# EAGLE design working (EAGLE 6.3)

## Sheet 1 of 4
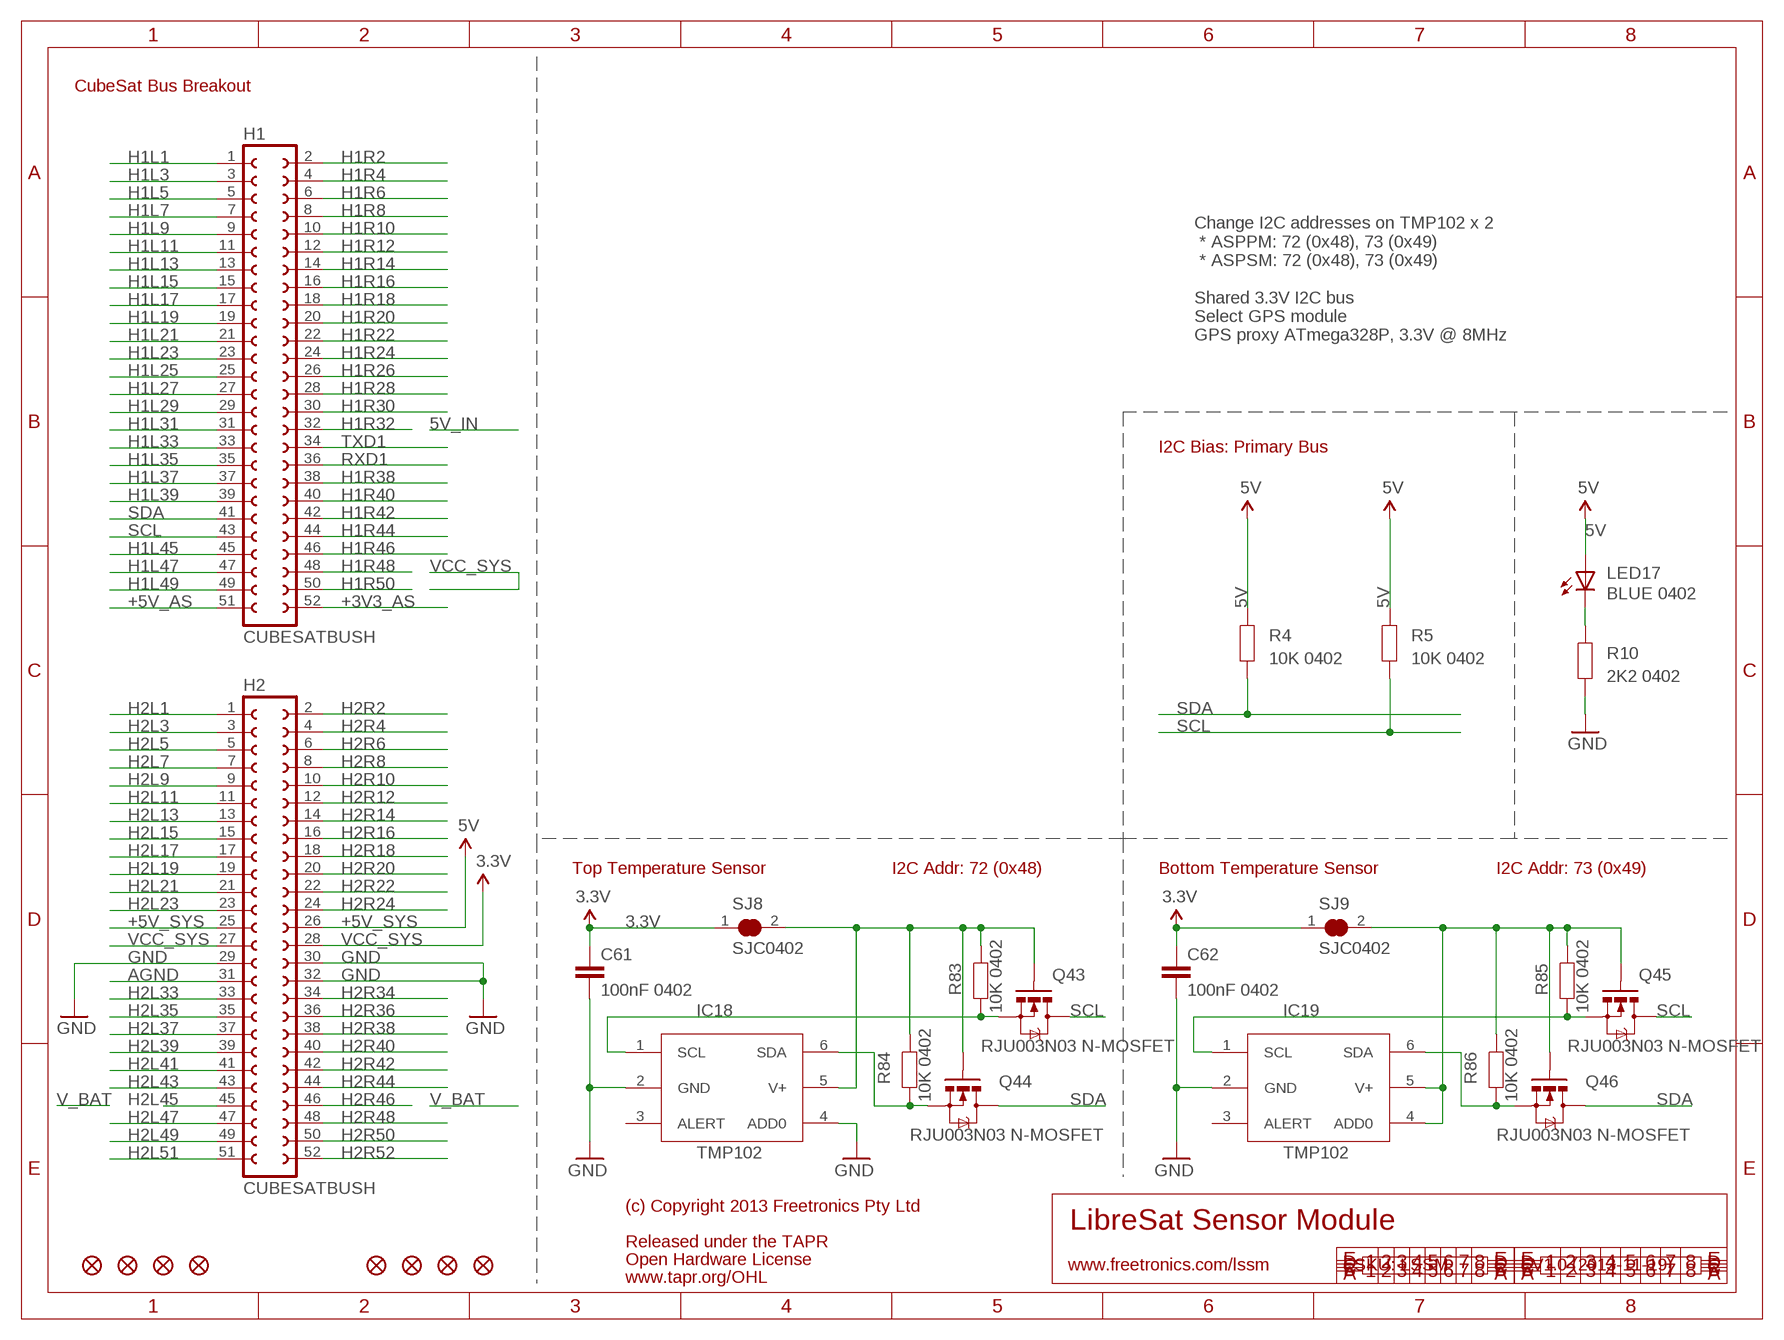
[diagram p0: schematic, sheet 1]

### Parts
C61  100nF 0402  C-EU0402C  [0402C]
C62  100nF 0402  C-EU0402C  [0402C]
FID1  FIDUCIAL1X2.5  [FIDUCIAL-1X2.5]
FID2  FIDUCIAL1X2.5  [FIDUCIAL-1X2.5]
FID3  FIDUCIAL1X2.5  [FIDUCIAL-1X2.5]
FID4  FIDUCIAL1X2.5  [FIDUCIAL-1X2.5]
FID5  FIDUCIAL1X2.5  [FIDUCIAL-1X2.5]
FID6  FIDUCIAL1X2.5  [FIDUCIAL-1X2.5]
FID7  FIDUCIAL1X2.5  [FIDUCIAL-1X2.5]
FID8  FIDUCIAL1X2.5  [FIDUCIAL-1X2.5]
H1  CUBESATBUSH  [CUBESATBUS]
H2  CUBESATBUSH  [CUBESATBUS]
IC18  TMP102  [SOT563]
IC19  TMP102  [SOT563]
LED17  BLUE 0402  LED0402  [LED-0402]
Q43  RJU003N03 N-MOSFET  MOSFET-NSOT-323  [SOT32-3]
Q44  RJU003N03 N-MOSFET  MOSFET-NSOT-323  [SOT32-3]
Q45  RJU003N03 N-MOSFET  MOSFET-NSOT-323  [SOT32-3]
Q46  RJU003N03 N-MOSFET  MOSFET-NSOT-323  [SOT32-3]
R4  10K 0402  RESISTOR0402  [0402]
R5  10K 0402  RESISTOR0402  [0402]
R10  2K2 0402  RESISTOR0402  [0402]
R83  10K 0402  RESISTOR0402  [0402]
R84  10K 0402  RESISTOR0402  [0402]
R85  10K 0402  RESISTOR0402  [0402]
R86  10K 0402  RESISTOR0402  [0402]
SJ8  SJC0402  [0402SJC]
SJ9  SJC0402  [0402SJC]

### Nets
3.3V: C61.1 C62.1 SJ8.1 SJ9.1 ; also sheet 3
5V: LED17.A R4.2 R5.2 ; also sheet 3,4
+3V3_AS: H1.52
+5V_AS: H1.51
+5V_SYS: H2.25 H2.26 ; supply symbol labelled 5V
AGND: H2.31
GND: C61.2 C62.2 H2.29 H2.30 H2.32 IC18.2(GND) IC18.4(ADD0) IC19.2(GND) R10.1 ; also sheet 2,3,4
H1L1: H1.1
H1L3: H1.3
H1L5: H1.5
H1L7: H1.7
H1L9: H1.9
H1L11: H1.11
H1L13: H1.13
H1L15: H1.15
H1L17: H1.17
H1L19: H1.19
H1L21: H1.21
H1L23: H1.23
H1L25: H1.25
H1L27: H1.27
H1L29: H1.29
H1L31: H1.31
H1L33: H1.33
H1L35: H1.35
H1L37: H1.37
H1L39: H1.39
H1L45: H1.45
H1L47: H1.47
H1L49: H1.49
H1R2: H1.2
H1R4: H1.4
H1R6: H1.6
H1R8: H1.8
H1R10: H1.10
H1R12: H1.12
H1R14: H1.14
H1R16: H1.16
H1R18: H1.18
H1R20: H1.20
H1R22: H1.22
H1R24: H1.24
H1R26: H1.26
H1R28: H1.28
H1R30: H1.30
H1R32: H1.32
H1R38: H1.38
H1R40: H1.40
H1R42: H1.42
H1R44: H1.44
H1R46: H1.46
H1R48: H1.48
H1R50: H1.50
H2L1: H2.1
H2L3: H2.3
H2L5: H2.5
H2L7: H2.7
H2L9: H2.9
H2L11: H2.11
H2L13: H2.13
H2L15: H2.15
H2L17: H2.17
H2L19: H2.19
H2L21: H2.21
H2L23: H2.23
H2L33: H2.33
H2L35: H2.35
H2L37: H2.37
H2L39: H2.39
H2L41: H2.41
H2L43: H2.43
H2L45: H2.45
H2L47: H2.47
H2L49: H2.49
H2L51: H2.51
H2R2: H2.2
H2R4: H2.4
H2R6: H2.6
H2R8: H2.8
H2R10: H2.10
H2R12: H2.12
H2R14: H2.14
H2R16: H2.16
H2R18: H2.18
H2R20: H2.20
H2R22: H2.22
H2R24: H2.24
H2R34: H2.34
H2R36: H2.36
H2R38: H2.38
H2R40: H2.40
H2R42: H2.42
H2R44: H2.44
H2R46: H2.46
H2R48: H2.48
H2R50: H2.50
H2R52: H2.52
N$14: LED17.C R10.2
N$9999: IC18.1(SCL) Q43.2(S) R83.1
N$10001: IC18.6(SDA) Q44.2(S) R84.1
N$10002: IC19.6(SDA) Q46.2(S) R86.1
N$10003: IC19.1(SCL) Q45.2(S) R85.1
N$10010: IC18.5(V+) Q43.1(G) Q44.1(G) R83.2 R84.2 SJ8.2
N$10011: IC19.4(ADD0) IC19.5(V+) Q45.1(G) Q46.1(G) R85.2 R86.2 SJ9.2
RXD1: H1.36 ; also sheet 2
SCL: H1.43 Q43.3(D) Q45.3(D) R5.1 ; also sheet 3,4
SDA: H1.41 Q44.3(D) Q46.3(D) R4.1 ; also sheet 3,4
TXD1: H1.34 ; also sheet 2
VCC_SYS: H2.27 H2.28 ; supply symbol labelled 3.3V
Unconnected: IC18.3(ALERT) IC19.3(ALERT)

### Notes on the sheet
- CubeSat Bus Breakout
- Change I2C addresses on TMP102 x 2
   * ASPPM: 72 (0x48), 73 (0x49)
   * ASPSM: 72 (0x48), 73 (0x49)
  
  Shared 3.3V I2C bus
  Select GPS module
  GPS proxy ATmega328P, 3.3V @ 8MHz
- I2C Bias: Primary Bus
- Top Temperature Sensor | I2C Addr: 72 (0x48) | Bottom Temperature Sensor | I2C Addr: 73 (0x49)
- (c) Copyright 2013 Freetronics Pty Ltd
- LibreSat Sensor Module
- Released under the TAPR
- Open Hardware License
- www.freetronics.com/lssm | SKU: LSSM | V1.0 (2013-11-19)
- www.tapr.org/OHL

## Sheet 2 of 4
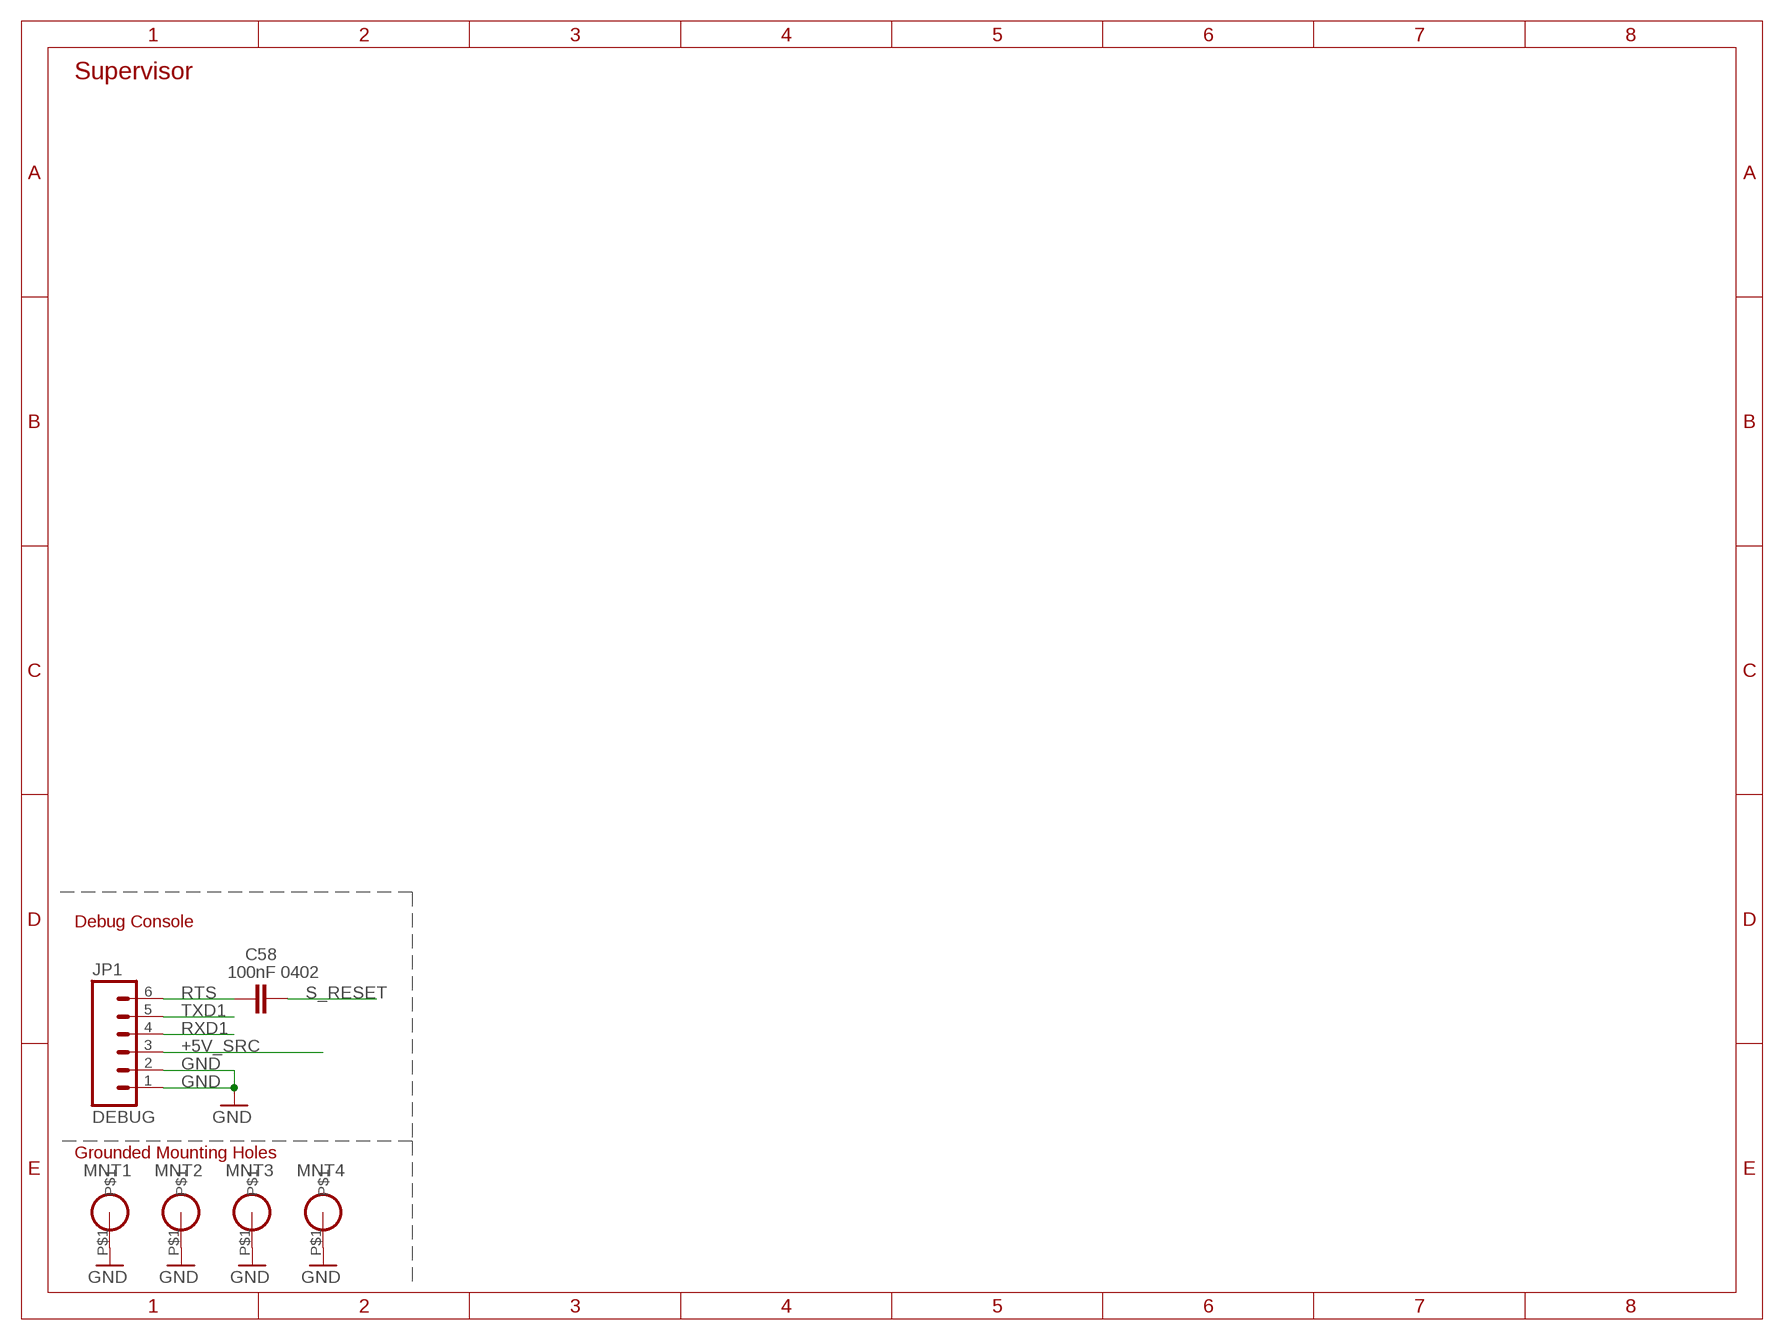
[diagram p1: schematic, sheet 2]

### Parts
C58  100nF 0402  C-EU0402C  [0402C]
JP1  DEBUG  M06RA  [MOLEX-1X6-RA]
MNT1  HOLE3.2MM  [HOLE32]
MNT2  HOLE3.2MM  [HOLE32]
MNT3  HOLE3.2MM  [HOLE32]
MNT4  HOLE3.2MM  [HOLE32]

### Nets
+5V_SRC: JP1.3
GND: JP1.1 JP1.2 MNT1.P$1 MNT2.P$1 MNT3.P$1 MNT4.P$1 ; also sheet 1,3,4
RTS: C58.1 JP1.6
RXD1: JP1.4 ; also sheet 1
S_RESET: C58.2
TXD1: JP1.5 ; also sheet 1

### Notes on the sheet
- Supervisor
- Debug Console
- Grounded Mounting Holes

## Sheet 3 of 4
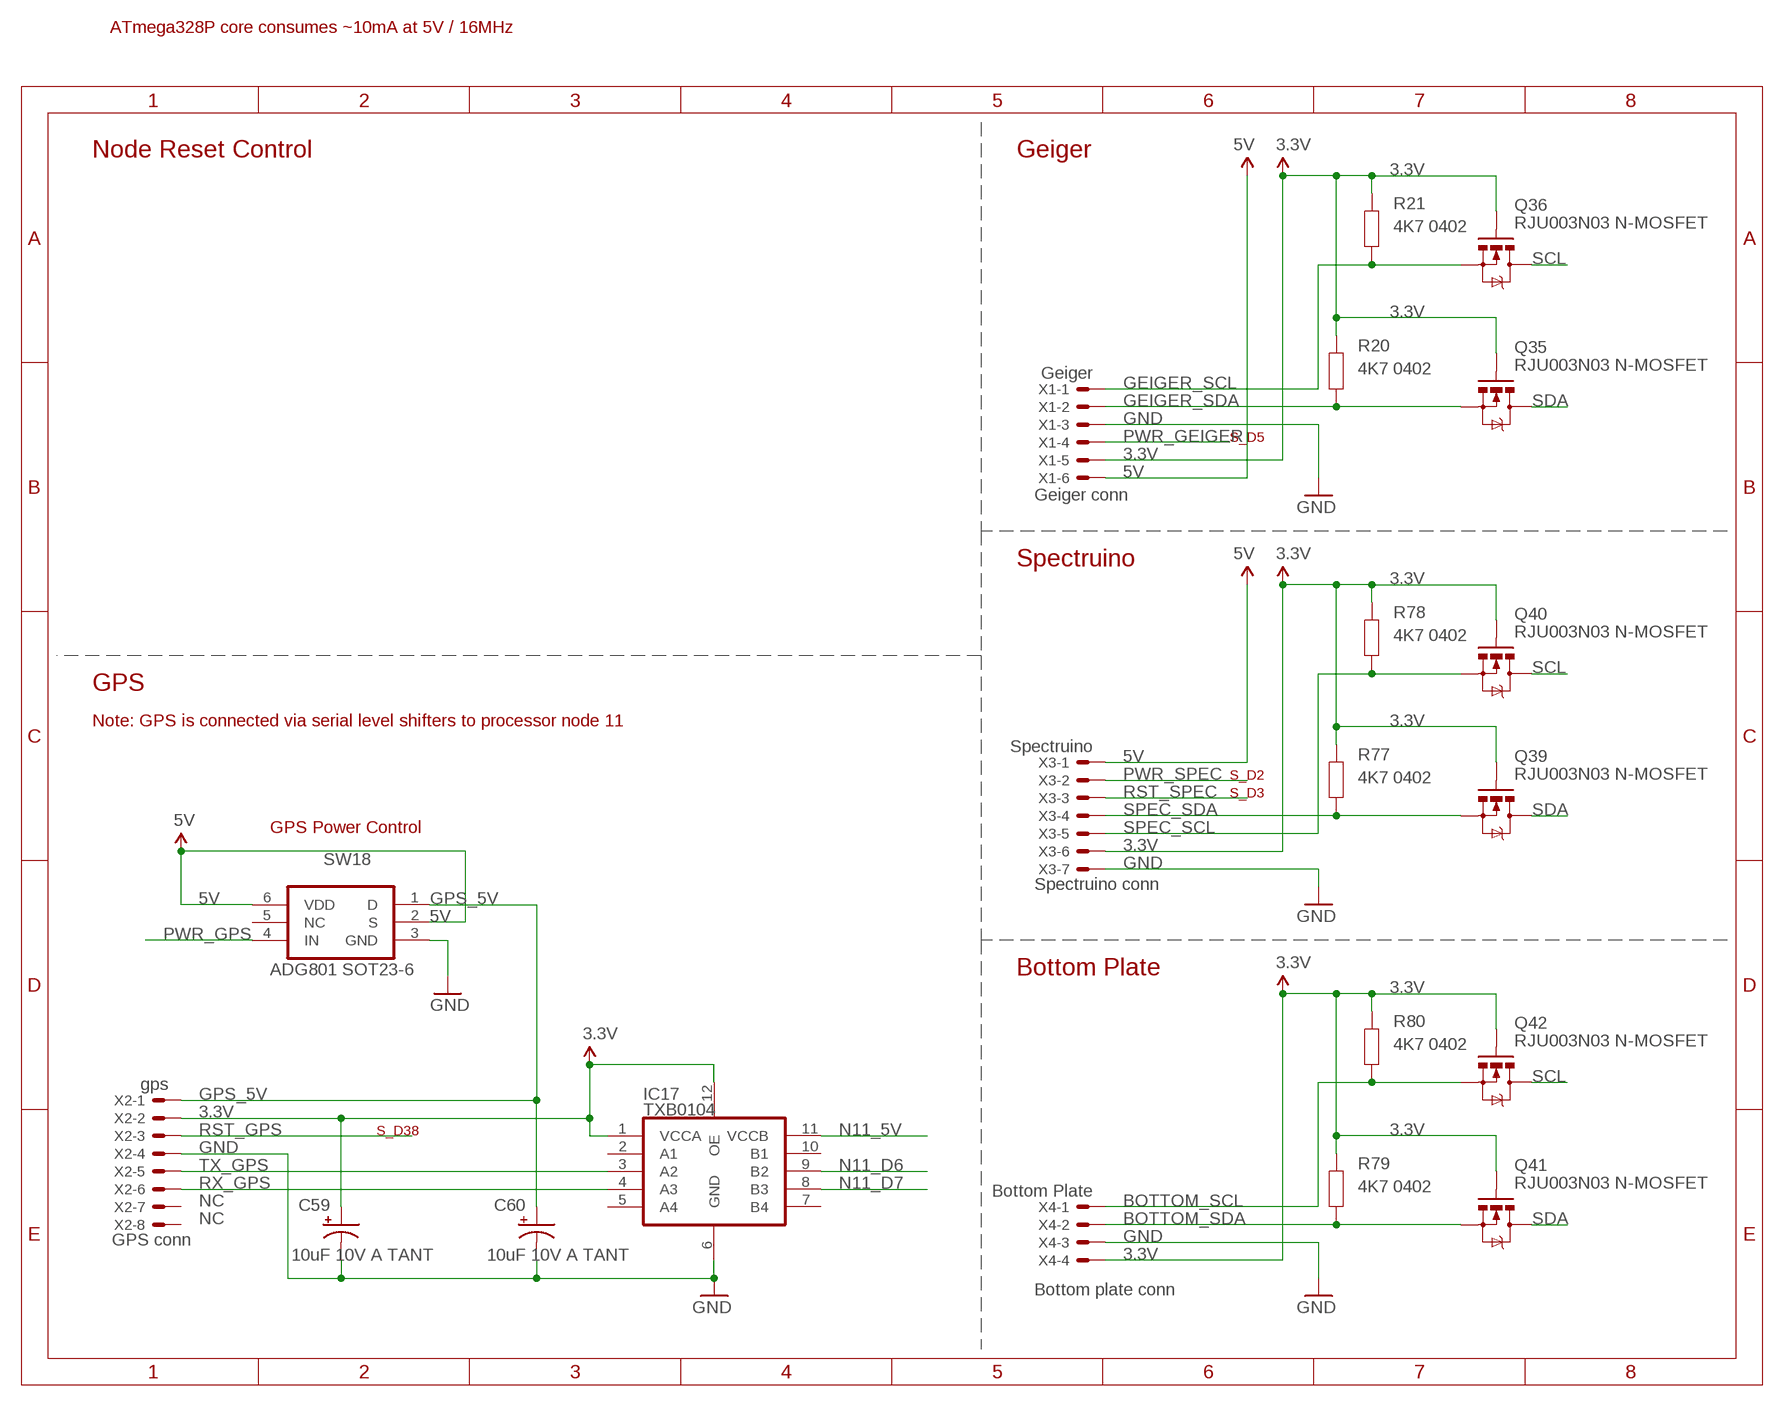
[diagram p2: schematic, sheet 3]

### Parts
C59  10uF 10V A TANT  CAP_POL1206  [EIA3216]
C60  10uF 10V A TANT  CAP_POL1206  [EIA3216]
IC17  TXB0104  [QFN-12]
Q35  RJU003N03 N-MOSFET  MOSFET-NSOT-323  [SOT32-3]
Q36  RJU003N03 N-MOSFET  MOSFET-NSOT-323  [SOT32-3]
Q39  RJU003N03 N-MOSFET  MOSFET-NSOT-323  [SOT32-3]
Q40  RJU003N03 N-MOSFET  MOSFET-NSOT-323  [SOT32-3]
Q41  RJU003N03 N-MOSFET  MOSFET-NSOT-323  [SOT32-3]
Q42  RJU003N03 N-MOSFET  MOSFET-NSOT-323  [SOT32-3]
R20  4K7 0402  RESISTOR0402  [0402]
R21  4K7 0402  RESISTOR0402  [0402]
R77  4K7 0402  RESISTOR0402  [0402]
R78  4K7 0402  RESISTOR0402  [0402]
R79  4K7 0402  RESISTOR0402  [0402]
R80  4K7 0402  RESISTOR0402  [0402]
SW18  ADG801 SOT23-6  ADG801SOT23-6  [SOT23-6]
X1  Geiger  53398-06  [53398-06]
X2  gps  53398-08  [53398-08]
X3  Spectruino  53398-07  [53398-07]
X4  Bottom Plate  53398-04  [53398-04]

### Nets
3.3V: C59.A(+) IC17.1(VCCA) IC17.12(OE) Q35.1(G) Q36.1(G) Q39.1(G) Q40.1(G) Q41.1(G) Q42.1(G) R20.2 R21.2 R77.2 R78.2 R79.2 R80.2 X1.5 X2.2 X3.6 X4.4 ; also sheet 1
5V: SW18.2(S) SW18.6(VDD) X1.6 X3.1 ; also sheet 1,4
BOTTOM_SCL: Q42.2(S) R80.1 X4.1
BOTTOM_SDA: Q41.2(S) R79.1 X4.2
GEIGER_SCL: Q36.2(S) R21.1 X1.1
GEIGER_SDA: Q35.2(S) R20.1 X1.2
GND: C59.C(-) C60.C(-) IC17.6(GND) SW18.3(GND) X1.3 X2.4 X3.7 X4.3 ; also sheet 1,2,4
GPS_5V: C60.A(+) SW18.1(D) X2.1
N11_5V: IC17.11(VCCB) ; also sheet 4
N11_D6: IC17.9(B2) ; also sheet 4
N11_D7: IC17.8(B3) ; also sheet 4
PWR_GEIGER: X1.4
PWR_GPS: SW18.4(IN)
PWR_SPEC: X3.2
RST_GPS: X2.3
RST_SPEC: X3.3
RX_GPS: IC17.4(A3) X2.6
SCL: Q36.3(D) Q40.3(D) Q42.3(D) ; also sheet 1,4
SDA: Q35.3(D) Q39.3(D) Q41.3(D) ; also sheet 1,4
SPEC_SCL: Q40.2(S) R78.1 X3.5
SPEC_SDA: Q39.2(S) R77.1 X3.4
TX_GPS: IC17.3(A2) X2.5
Unconnected: IC17.2(A1) IC17.5(A4) IC17.7(B4) IC17.10(B1) SW18.5(NC) X2.7 X2.8

### Notes on the sheet
- ATmega328P core consumes ~10mA at 5V / 16MHz
- Node Reset Control | Geiger
- S_D5
- Geiger conn
- Spectruino
- GPS
- Note: GPS is connected via serial level shifters to processor node 11
- S_D2
- S_D3
- GPS Power Control
- Spectruino conn
- Bottom Plate
- S_D38
- NC
- NC
- GPS conn
- Bottom plate conn

## Sheet 4 of 4
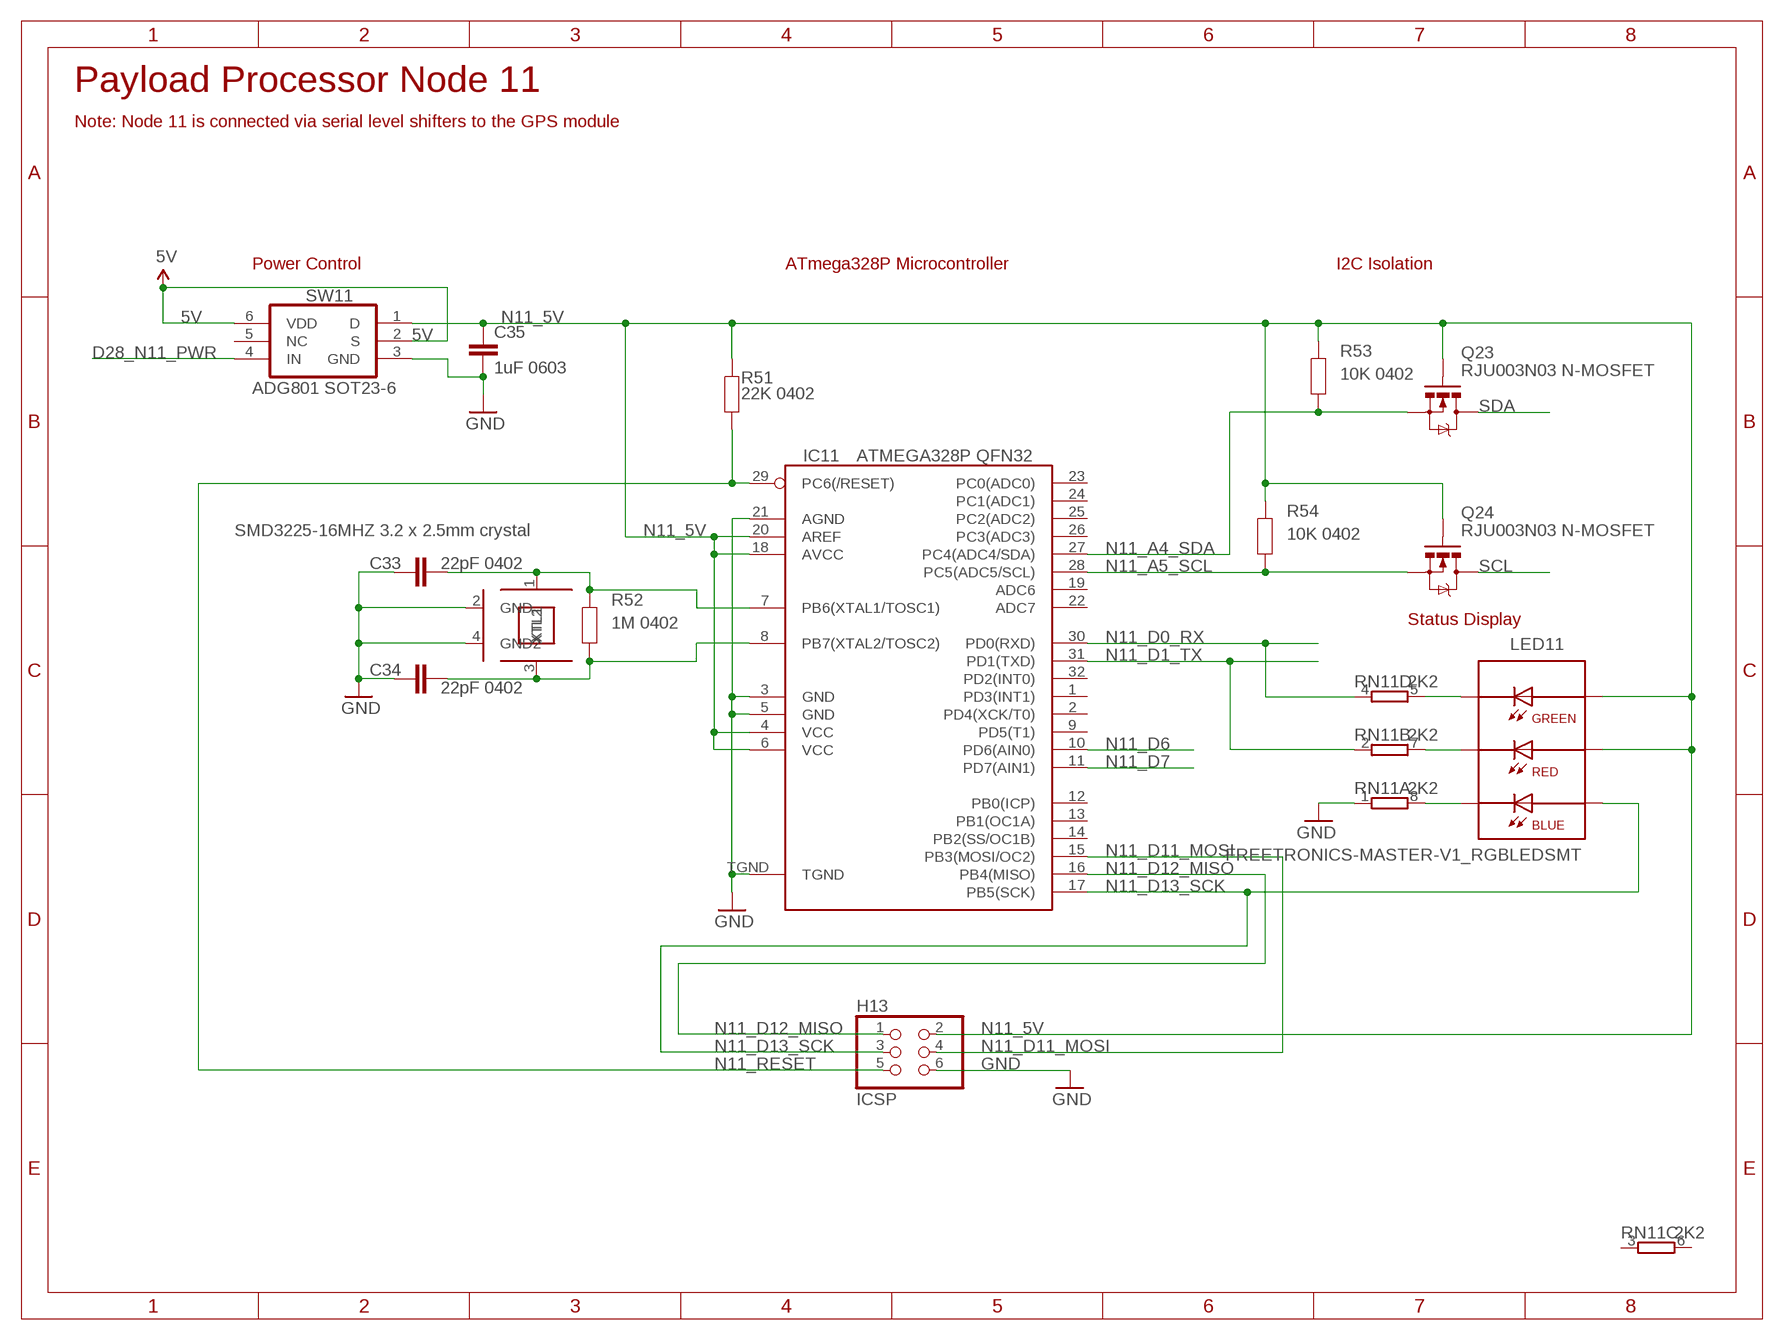
[diagram p3: schematic, sheet 4]

### Parts
C33  22pF 0402  C-EU0402C  [0402C]
C34  22pF 0402  C-EU0402C  [0402C]
C35  1uF 0603  C-EUC0603  [C0603]
H13  ICSP  ICSP2X3-2MM  [M2X3-2MM]
IC11  ATMEGA328P QFN32  AVR-MEGA8-MI  [MLF32]
LED11  FREETRONICS-MASTER-V1_RGBLEDSMT  [FREETRONICS-MASTER-V1_19-337]
Q23  RJU003N03 N-MOSFET  MOSFET-NSOT-323  [SOT32-3]
Q24  RJU003N03 N-MOSFET  MOSFET-NSOT-323  [SOT32-3]
R51  22K 0402  RESISTOR0402  [0402]
R52  1M 0402  RESISTOR0402  [0402]
R53  10K 0402  RESISTOR0402  [0402]
R54  10K 0402  RESISTOR0402  [0402]
RN11  2K2  4R-NCAY16  [CAY16]
SW11  ADG801 SOT23-6  ADG801SOT23-6  [SOT23-6]
XTL11  SMD3225-8MHZ 3.2 x 2.5mm crystal  CRYSTAL-GND3X2  [CRYSTAL-SMD-3X2]

### Nets
5V: SW11.2(S) SW11.6(VDD) ; also sheet 1,3
D28_N11_PWR: SW11.4(IN)
GND: C33.1 C34.1 C35.2 H13.6 IC11.3(GND) IC11.5(GND) IC11.21(AGND) IC11.TGND RN11.1 SW11.3(GND) XTL11.2(GND) XTL11.4(GND2) ; also sheet 1,2,3
N11_5V: C35.1 H13.2 IC11.4(VCC) IC11.6(VCC) IC11.18(AVCC) IC11.20(AREF) LED11.5(A-R) LED11.6(A-G) Q23.1(G) Q24.1(G) R51.2 R53.2 R54.2 SW11.1(D) ; also sheet 3
N11_A4_SDA: IC11.27(PC4(ADC4/SDA)) Q23.2(S) R53.1
N11_A5_SCL: IC11.28(PC5(ADC5/SCL)) Q24.2(S) R54.1
N11_D0_RX: IC11.30(PD0(RXD)) RN11.4
N11_D1_TX: IC11.31(PD1(TXD)) RN11.2
N11_D6: IC11.10(PD6(AIN0)) ; also sheet 3
N11_D7: IC11.11(PD7(AIN1)) ; also sheet 3
N11_D11_MOSI: H13.4 IC11.15(PB3(MOSI/OC2))
N11_D12_MISO: H13.1 IC11.16(PB4(MISO))
N11_D13_SCK: H13.3 IC11.17(PB5(SCK)) LED11.4(A-B)
N11_RESET: H13.5 IC11.29(PC6(/RESET)) R51.1
N$6470: C34.2 IC11.8(PB7(XTAL2/TOSC2)) R52.1 XTL11.3(XTL2)
N$6471: C33.2 IC11.7(PB6(XTAL1/TOSC1)) R52.2 XTL11.1(XTL1)
N$6472: LED11.2(C-R) RN11.7
N$6473: LED11.1(C-B) RN11.8
N$6474: LED11.3(C-G) RN11.5
SCL: Q24.3(D) ; also sheet 1,3
SDA: Q23.3(D) ; also sheet 1,3
Unconnected: IC11.1(PD3(INT1)) IC11.2(PD4(XCK/T0)) IC11.9(PD5(T1)) IC11.12(PB0(ICP)) IC11.13(PB1(OC1A)) IC11.14(PB2(SS/OC1B)) IC11.19(ADC6) IC11.22(ADC7) IC11.23(PC0(ADC0)) IC11.24(PC1(ADC1)) IC11.25(PC2(ADC2)) IC11.26(PC3(ADC3)) IC11.32(PD2(INT0)) RN11.3 RN11.6 SW11.5(NC)

### Notes on the sheet
- Payload Processor Node 11
- Note: Node 11 is connected via serial level shifters to the GPS module
- Power Control | ATmega328P Microcontroller | I2C Isolation
- SMD3225-16MHZ 3.2 x 2.5mm crystal
- Status Display

## Library data of the parts
C33-C35 C58 C61 C62 = freetronics-jon:C-EU: CAPACITOR, European symbol
C59 C60 = freetronics-jon:CAP_POL: Capacitor Polarized These are standard SMD and PTH capacitors. Normally 10uF, 47uF, and 100uF in electrolytic and tantalum varieties. Always verify the external diameter of the through hole cap, it varies with capacity, voltage, and manufacturer. The EIA devices should be standard.
FID1-FID8 = freetronics:FIDUCIAL: Fiducial Alignment Points Various fiducial points for machine vision alignment.
H1 H2 = freetronics-jon:CUBESATBUS
H13 = freetronics-jon:ICSP
IC11 = freetronics-jon:AVR-MEGA8: MICROCONTROLLER 8 Kbytes FLASH 1 kbytes SRAM 512 bytes EEPROM USART 6-channel 10 bit ADC 2-channel 8 bit ADC
IC17 = freetronics-jon:TXB0104
IC18 IC19 = freetronics-jon:TMP102
JP1 = freetronics-master-v1:M06: Header 6 Standard 6-pin 0.1" header. Use with straight break away headers (SKU : PRT-00116), right angle break away headers (PRT-00553), swiss pins (PRT-00743), machine pins (PRT-00117), and female headers (PRT-00115). Molex polarized connector foot print use with SKU : PRT-08094 with associated crimp pins and housings. NOTES ON THE VARIANTS LOCK and LOCK_LONGPADS... This footprint was designed to help hold the alignment of a through-hole component (i.e. 6-pin header) while soldering it into place. You may notice that each hole has been shifted either up or down by 0.005 of an inch from it's more standard position (which is a perfectly straight line). This slight alteration caused the pins (the squares in the middle) to touch the edges of the holes. Because they are alternating, it causes a "brace" to hold the component in place. 0.005 has proven to be the perfect amount of "off-center" position when using our standard breakaway headers. Although looks a little odd when you look at the bare footprint, once you have a header in there, the alteration is very hard to notice. Also, if you push a header all the way into place, it is covered up entirely on the bottom side. This idea of altering the position of holes to aid alignment will be further integrated into the Sparkfun Library for other footprints. It can help hold any component with 3 or more connection pins.
LED11 = freetronics-master-v1:FREETRONICS-MASTER-V1_RGBLED
LED17 = freetronics-jon:LED: LEDs Standard schematic elements and footprints for 5mm, 3mm, 1206, and 0603 sized LEDs. 5mm - Spark Fun Electronics SKU : COM-00529 (and others)
MNT1-MNT4 = freetronics-jon:HOLE
Q23 Q24 Q35 Q36 Q39-Q46 = freetronics-jon:MOSFET-N: Basic N-Channel MOSFET
R4 R5 R10 R20 R21 R51-R54 R77-R80 R83-R86 = freetronics-jon:RESISTOR: Resistor Basic schematic elements and footprints for 0603, 1206, and PTH 1/10th watt (small) resistors.
RN11 = resistor-dil:4R-N: Array Chip Resistor Source: RS Component / Phycomp; OC_FARNELL: unknown; OC_NEWARK: unknown
SJ8 SJ9 = freetronics-jon:SJC
SW11 SW18 = freetronics-jon:ADG801
X1 = con-molex:53?-06: CONNECTOR wire to board 1.25 mm (.049 inch) pitch header; OC_FARNELL: 1125368; OC_NEWARK: unknown
X2 = con-molex:53?-08: CONNECTOR wire to board 1.25 mm (.049 inch) pitch header; OC_FARNELL: 1125371; OC_NEWARK: unknown
X3 = con-molex:53?-07: CONNECTOR wire to board 1.25 mm (.049 inch) pitch header; OC_FARNELL: 9786368; OC_NEWARK: unknown
X4 = con-molex:53?-04: CONNECTOR wire to board 1.25 mm (.049 inch) pitch header; OC_FARNELL: 1125367; OC_NEWARK: unknown
XTL11 = freetronics-jon:CRYSTAL-GND

## Board
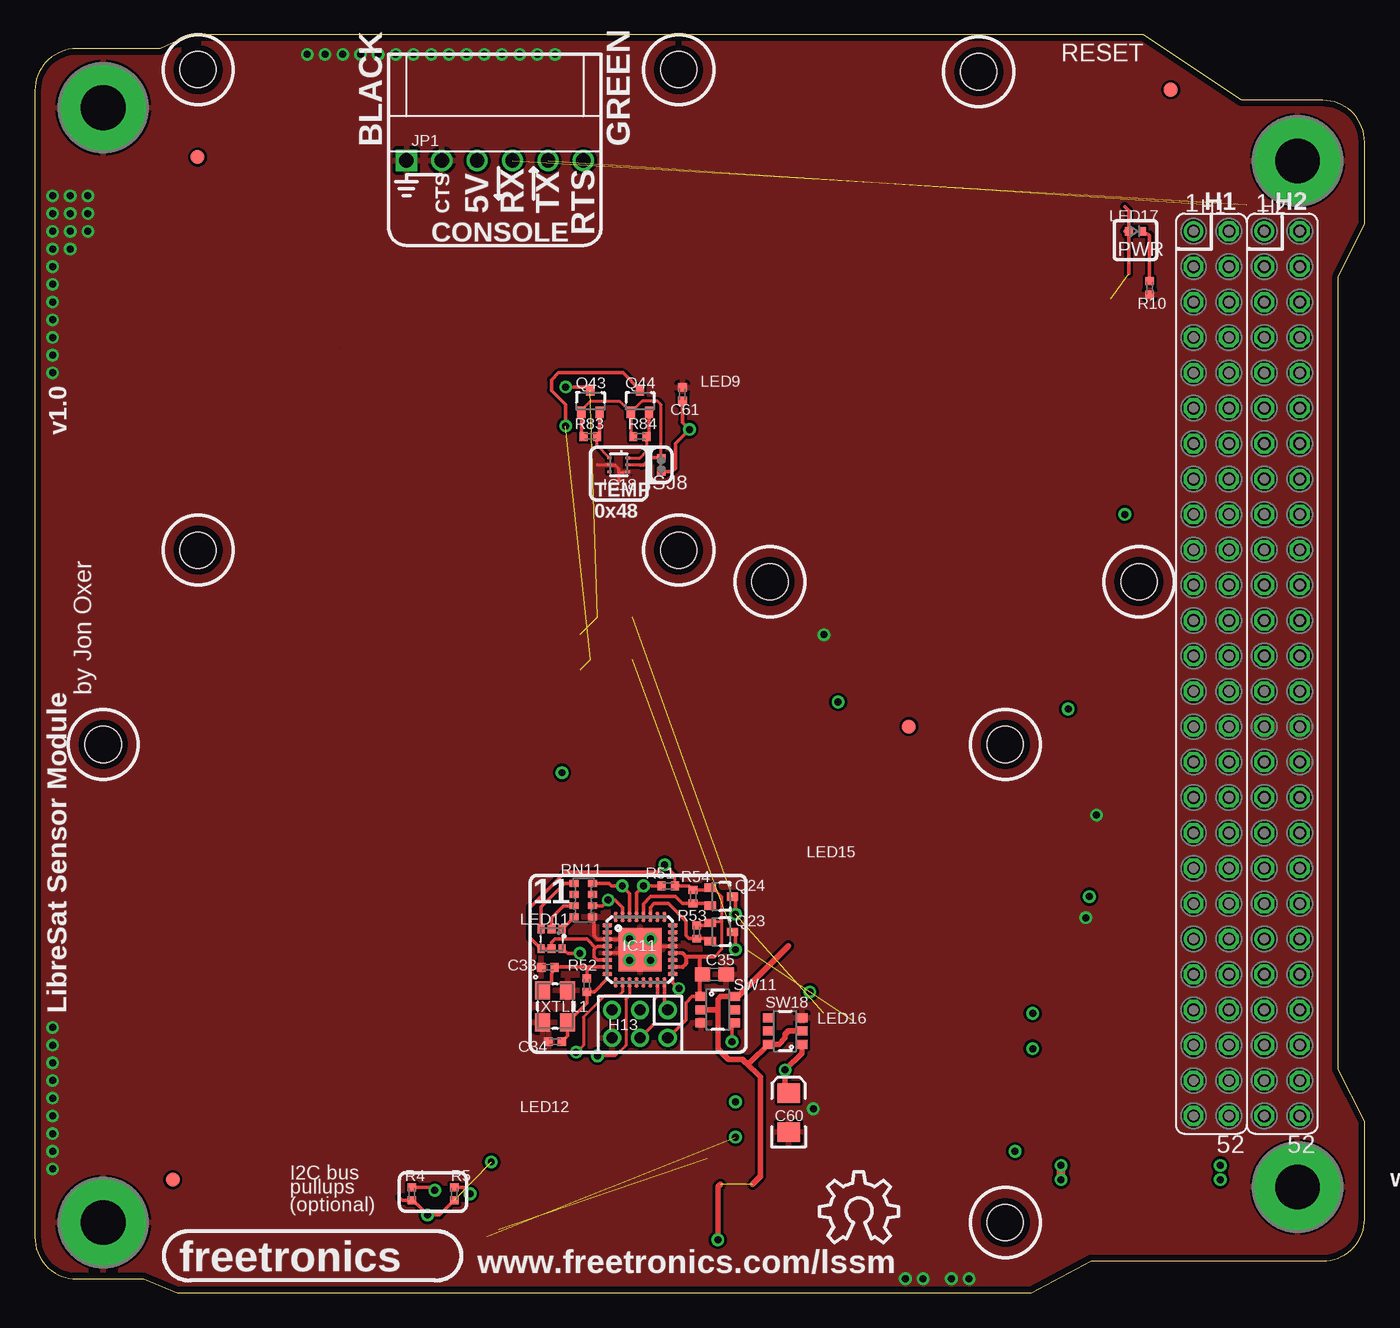
[diagram p4: board, top side]
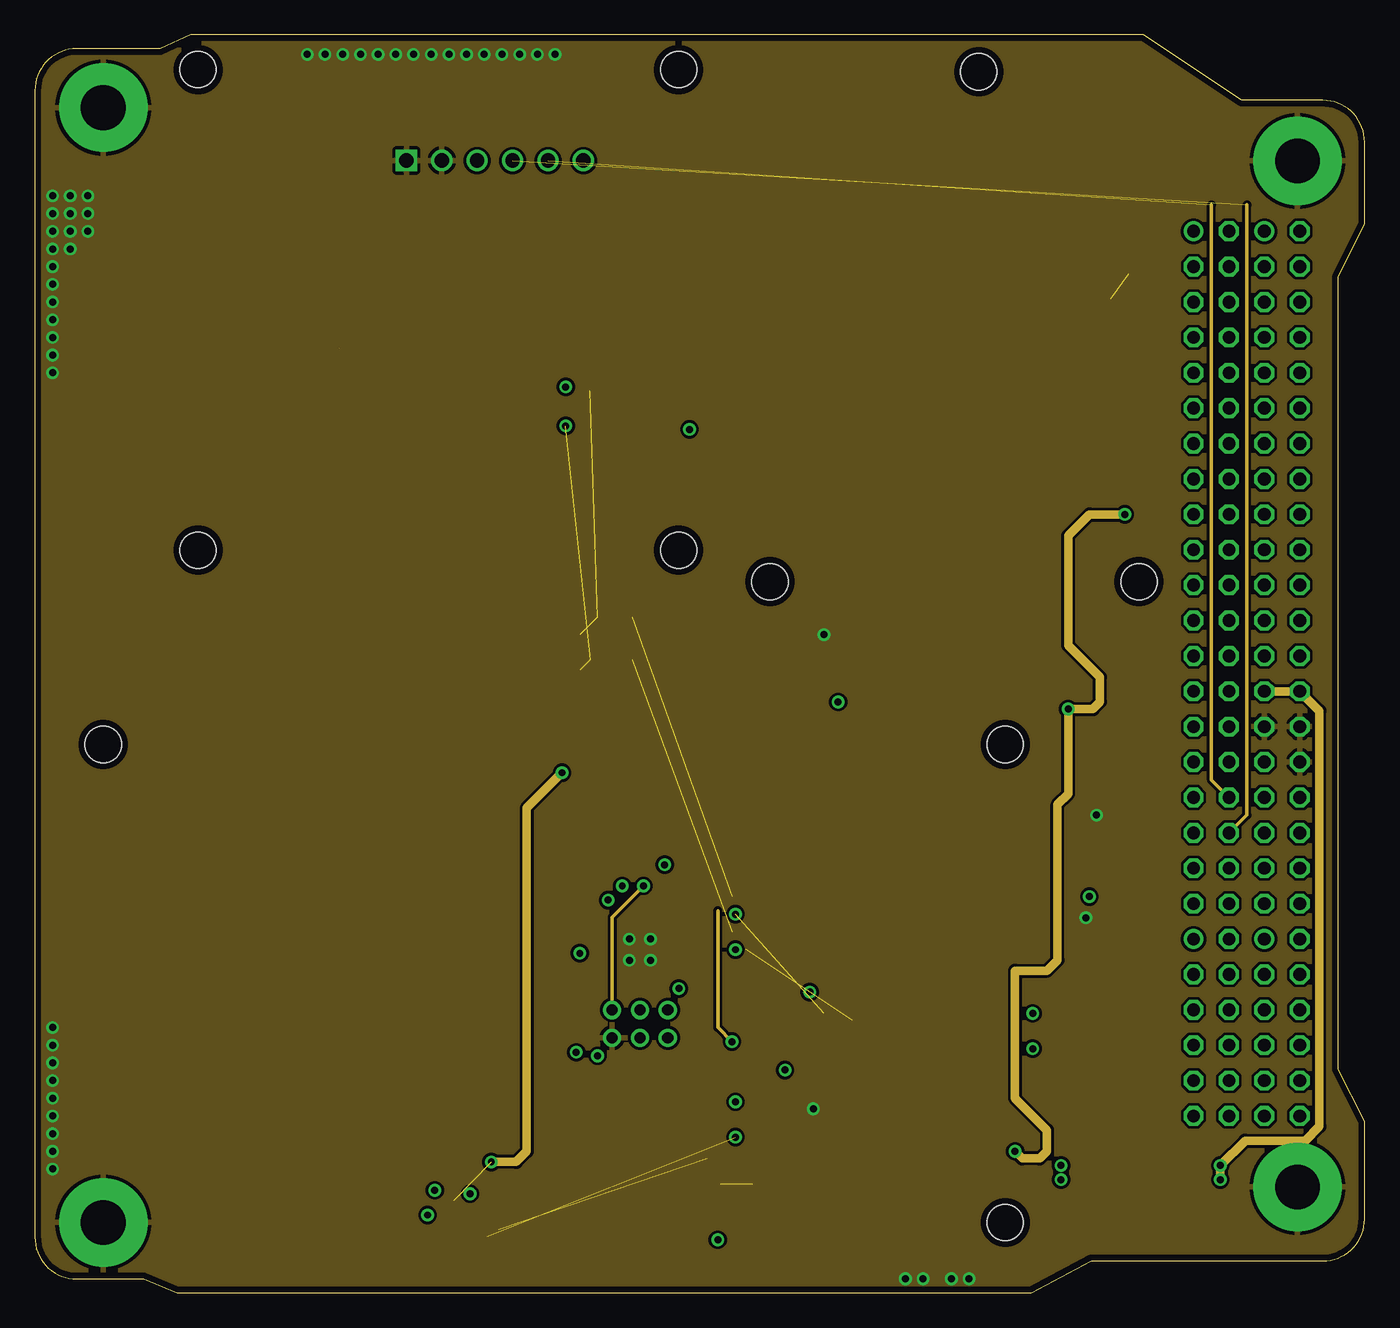
[diagram p5: board, inner layer Route2]
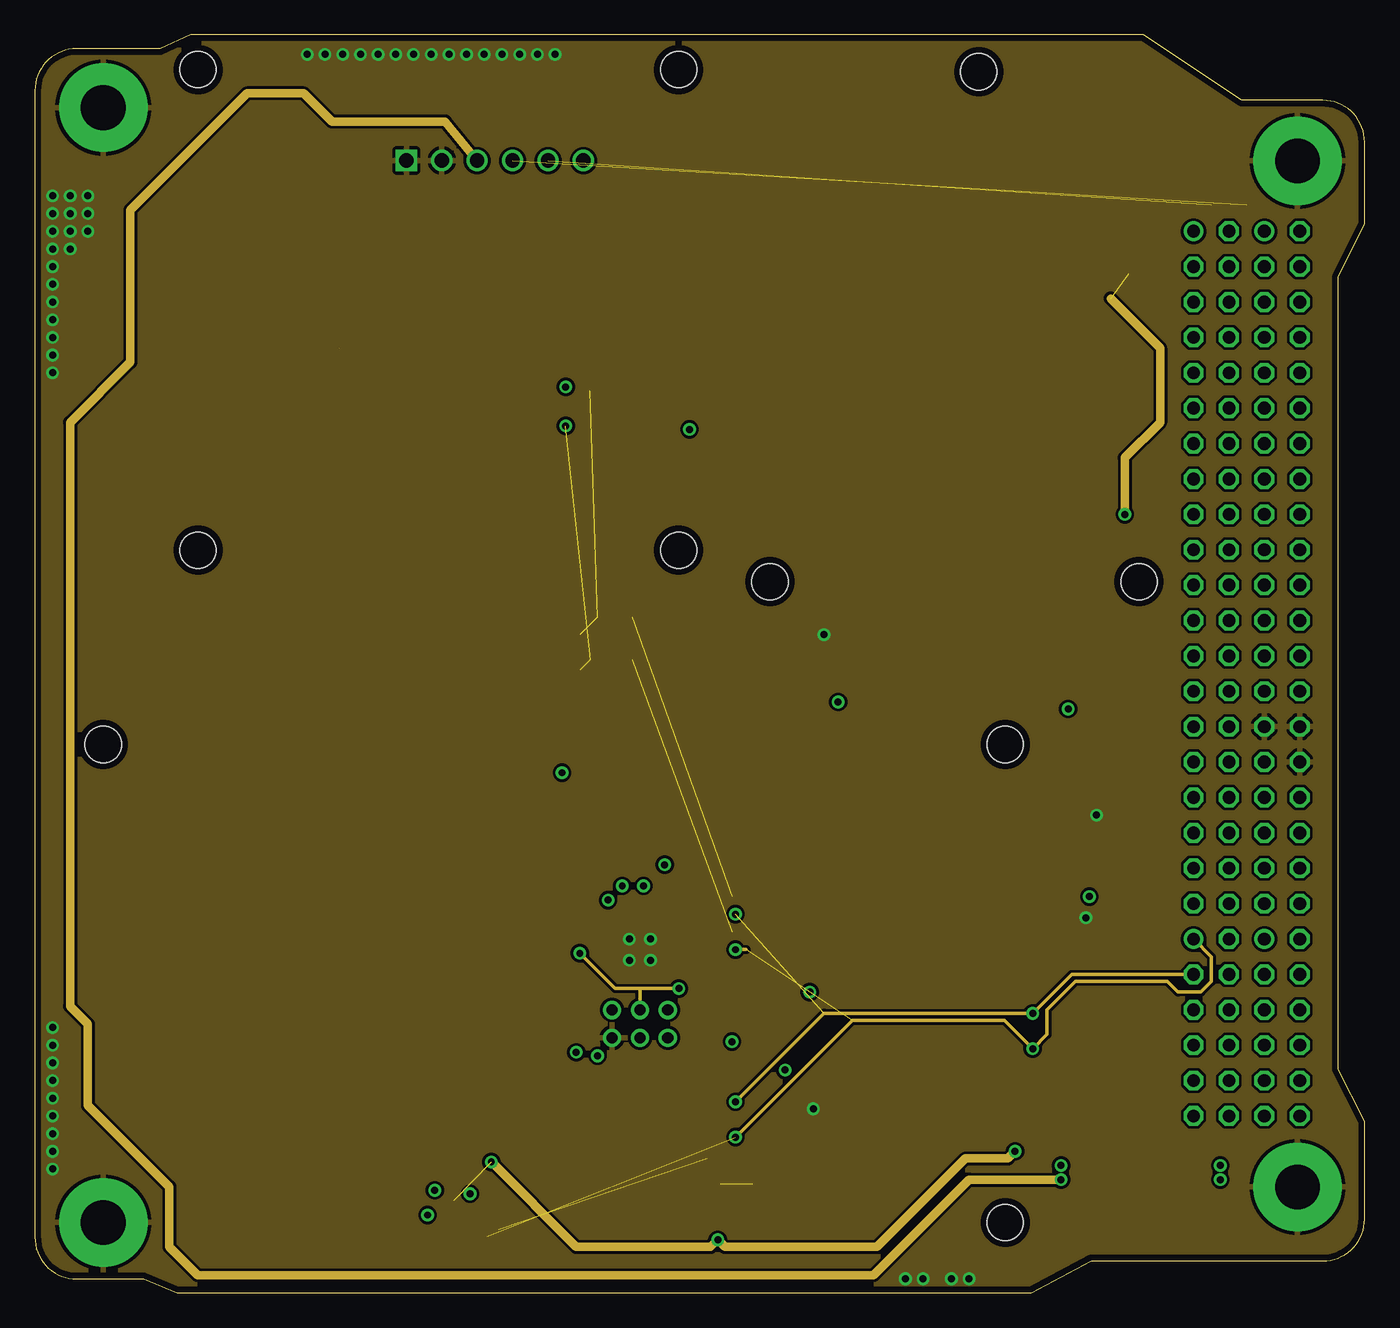
[diagram p6: board, inner layer Route15]
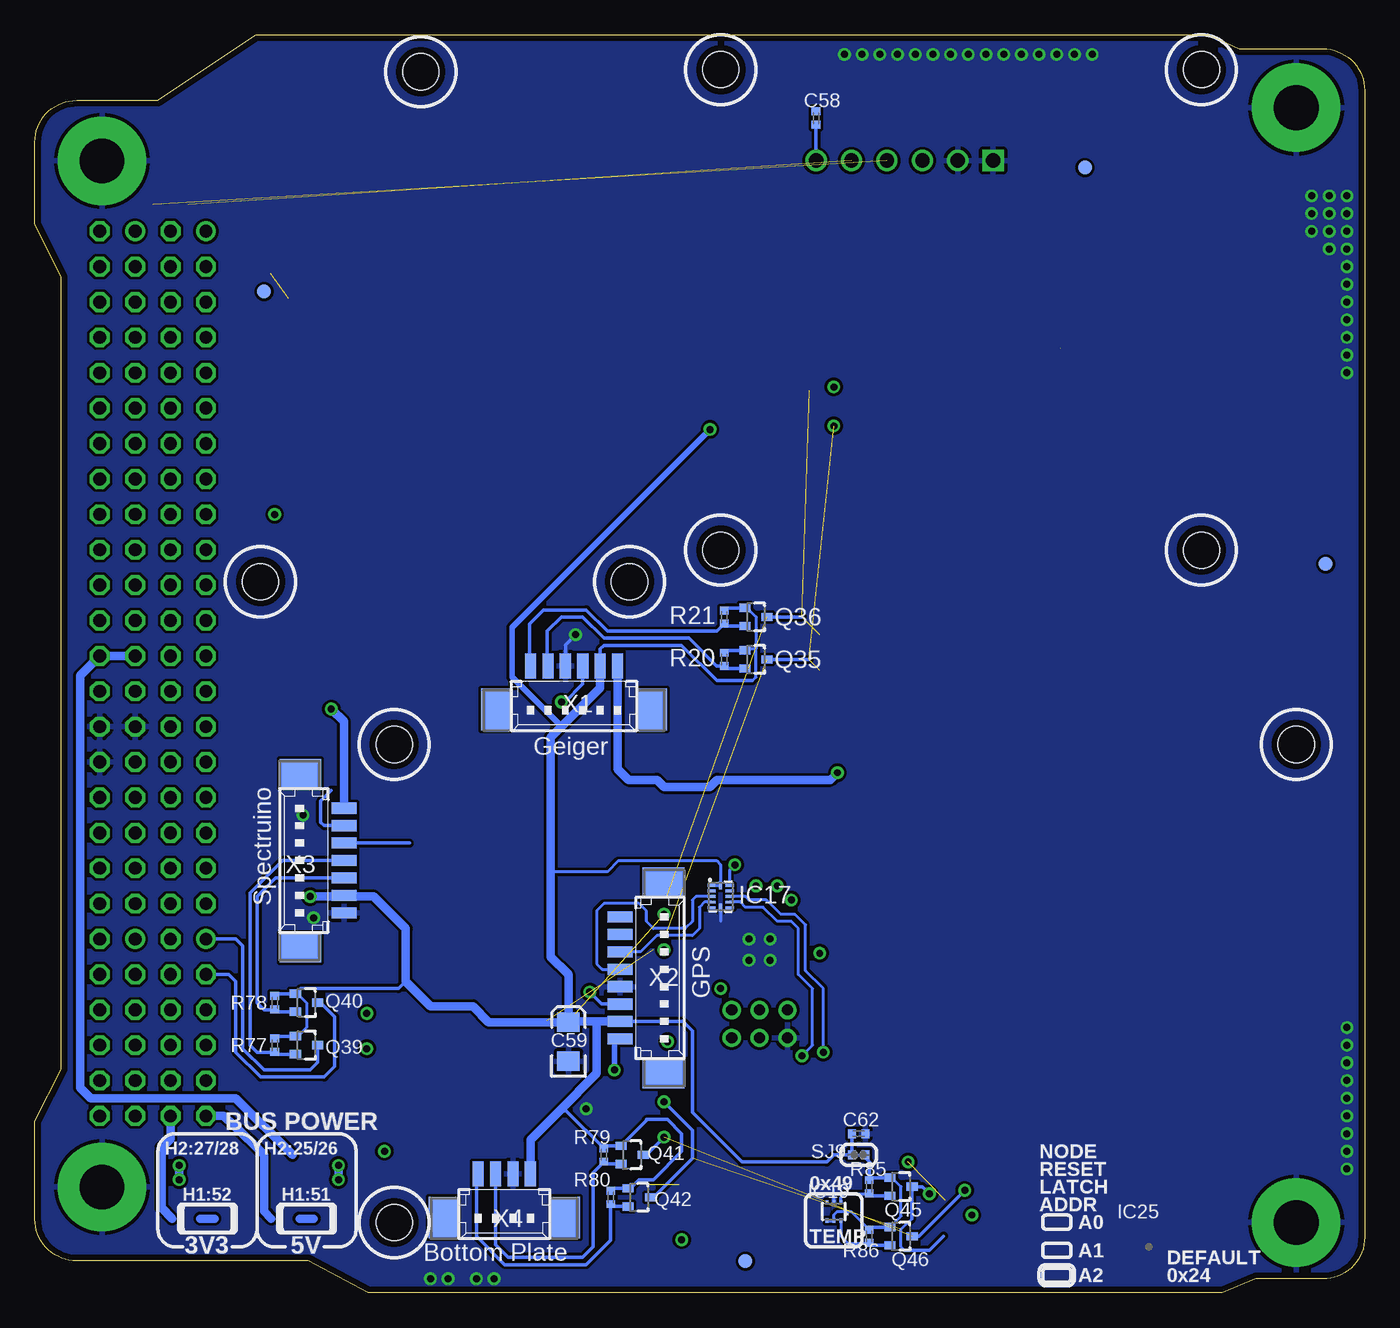
[diagram p7: board, bottom side, seen from below]

Size 95.45 x 90.3 mm. Coordinates in mm from the lower left corner, seen from the top.
Outline: 0,4 arc90 3,1 7.81,1 10.23,0 71.54,0 75.83,2.3 92.45,2.3 arc90 95.45,5.3 95.45,12.31 93.55,16.05 93.55,72.91 95.45,76.74 95.45,82.6 arc90 92.45,85.6 86.64,85.6 79.56,90.3 11.2,90.3 9,89.3 3,89.3 arc90 0,86.3 0,4
Copper layers (1+2*15+16): Top 0.035mm / dielectric 1.5mm / Route2 0.035mm / dielectric 0.15mm / Route15 0.035mm / dielectric 0.2mm / Bottom 0.035mm
Design rules "default *": minimum track width 6mil, minimum drill 19mil, track to track 6mil, track to pad 12mil, pad to pad 12mil, via to via 12mil, smd to smd 8mil, copper to edge 18mil, drill to drill 8mil, minimum pad ring 10mil, minimum via ring 8mil, stop-mask expansion 4mil, vias tented up to drill 20mil, thermal gap 10mil
Holes 2.6 mm at 11.72,87.8 46.21,87.8 67.75,87.65 11.72,53.31 46.21,53.31 52.76,51.05 79.26,51.05 69.65,39.37 4.91,39.37 69.65,5.05

### Footprints (pad centres in the part's own frame; a part is rotated, then mirrored left to right if it is on the bottom)
0402C = smd 0.59 x 0.64: 1 -0.48,0; 2 0.48,0
C0603 = smd 1.1 x 1: 1 -0.85,0; 2 0.85,0
EIA3216 = smd 1.4 x 1.6: A 1.4,0; C -1.4,0
FIDUCIAL-1X2.5 = smd 1 x 1: 1 0,0
CUBESATBUS = drill 0.914: 1 -31.75,-1.27; 41 19.05,-1.27 | drill 0.914 octagon: 2 -31.75,1.27; 3 -29.21,-1.27; 4 -29.21,1.27; 5 -26.67,-1.27; 6 -26.67,1.27; 7 -24.13,-1.27; 8 -24.13,1.27; 9 -21.59,-1.27; 10 -21.59,1.27; 11 -19.05,-1.27; 12 -19.05,1.27; 13 -16.51,-1.27; 14 -16.51,1.27; 15 -13.97,-1.27; 16 -13.97,1.27; 17 -11.43,-1.27; 18 -11.43,1.27; 19 -8.89,-1.27; 20 -8.89,1.27; 21 -6.35,-1.27; 22 -6.35,1.27; 23 -3.81,-1.27; 24 -3.81,1.27; 25 -1.27,-1.27; 26 -1.27,1.27; 27 1.27,-1.27; 28 1.27,1.27; 29 3.81,-1.27; 30 3.81,1.27; 31 6.35,-1.27; 32 6.35,1.27; 33 8.89,-1.27; 34 8.89,1.27; 35 11.43,-1.27; 36 11.43,1.27; 37 13.97,-1.27; 38 13.97,1.27; 39 16.51,-1.27; 40 16.51,1.27; 42 19.05,1.27; 43 21.59,-1.27; 44 21.59,1.27; 45 24.13,-1.27; 46 24.13,1.27; 47 26.67,-1.27; 48 26.67,1.27; 49 29.21,-1.27; 50 29.21,1.27; 51 31.75,-1.27; 52 31.75,1.27
M2X3-2MM = drill 0.8: 1 2,1; 2 2,-1; 3 0,1; 4 0,-1; 5 -2,1; 6 -2,-1
MLF32 = smd 0.7 x 0.3: 1 -2.35,1.75; 2 -2.35,1.25; 3 -2.35,0.75; 4 -2.35,0.25; 5 -2.35,-0.25; 6 -2.35,-0.75; 7 -2.35,-1.25; 8 -2.35,-1.75; 17 2.35,-1.75; 18 2.35,-1.25; 19 2.35,-0.75; 20 2.35,-0.25; 21 2.35,0.25; 22 2.35,0.75; 23 2.35,1.25; 24 2.35,1.75 | smd 0.3 x 0.7: 9 -1.75,-2.35; 10 -1.25,-2.35; 11 -0.75,-2.35; 12 -0.25,-2.35; 13 0.25,-2.35; 14 0.75,-2.35; 15 1.25,-2.35; 16 1.75,-2.35; 25 1.75,2.35; 26 1.25,2.35; 27 0.75,2.35; 28 0.25,2.35; 29 -0.25,2.35; 30 -0.75,2.35; 31 -1.25,2.35; 32 -1.75,2.35 | smd 3.1 x 3.1: TGND 0,0
QFN-12 = smd 0.2 x 0.6: 1 -0.8,-0.65; 2 -0.4,-0.65; 3 0,-0.65; 4 0.4,-0.65; 5 0.8,-0.65; 7 0.8,0.65; 8 0.4,0.65; 9 0,0.65; 10 -0.4,0.65; 11 -0.8,0.65 | smd 0.6 x 0.2: 6 0.8,0; 12 -0.8,0
SOT563 = smd 0.2 x 0.3: 1 -0.5,-0.65; 2 0,-0.65; 3 0.5,-0.65; 4 0.5,0.65; 5 0,0.65; 6 -0.5,0.65
MOLEX-1X6-RA = drill 1.016 square: 1 0,0 | drill 1.016: 2 2.54,0; 3 5.08,0; 4 7.62,0; 5 10.16,0; 6 12.7,0
FREETRONICS-MASTER-V1_19-337 = smd 0.6 x 0.5: 1 -0.7,0.75; 3 -0.7,-0.75; 4 0.7,0.75; 6 0.7,-0.75 | smd 0.6 x 0.6: 2 -0.7,0; 5 0.7,0
LED-0402 = smd 0.571 x 0.62: A -0.48,0; C 0.48,0
HOLE32 = drill 3.2 pad 6.35: P$1 0,0
SOT32-3 = smd 0.6 x 0.8: 1 -0.65,-0.8; 2 0.65,-0.8; 3 0,0.8
0402 = smd 0.571 x 0.62: 1 -0.48,0; 2 0.48,0
CAY16 = smd 0.5 x 0.65: 1 -1.2,-0.675; 2 -0.4,-0.675; 3 0.4,-0.675; 4 1.2,-0.675; 5 1.2,0.675; 6 0.4,0.675; 7 -0.4,0.675; 8 -1.2,0.675
0402SJC = smd 0.571 x 0.62: 1 -0.48,0; 2 0.48,0
SOT23-6 = smd 0.65 x 0.8: 1 -0.95,-1.2; 2 0,-1.2; 3 0.95,-1.2; 4 0.95,1.2; 5 0,1.2; 6 -0.95,1.2
53398-06 = smd 0.8 x 1.8: 1 3.125,-2.5; 2 1.875,-2.5; 3 0.625,-2.5; 4 -0.625,-2.5; 5 -1.875,-2.5; 6 -3.125,-2.5 | smd 2.1 x 3: S1 5.625,0.625; S2 -5.625,0.625
53398-08 = smd 0.8 x 1.8: 1 4.375,-2.5; 2 3.125,-2.5; 3 1.875,-2.5; 4 0.625,-2.5; 5 -0.625,-2.5; 6 -1.875,-2.5; 7 -3.125,-2.5; 8 -4.375,-2.5 | smd 2.1 x 3: S1 6.875,0.625; S2 -6.875,0.625
53398-07 = smd 0.8 x 1.8: 1 3.75,-2.5; 2 2.5,-2.5; 3 1.25,-2.5; 4 0,-2.5; 5 -1.25,-2.5; 6 -2.5,-2.5; 7 -3.75,-2.5 | smd 2.1 x 3: S1 6.25,0.625; S2 -6.25,0.625
53398-04 = smd 0.8 x 1.8: 1 1.875,-2.5; 2 0.625,-2.5; 3 -0.625,-2.5; 4 -1.875,-2.5 | smd 2.1 x 3: S1 4.375,0.625; S2 -4.375,0.625
CRYSTAL-SMD-3X2 = smd 1.3 x 1.1: 1 -1.15,-0.9; 2 1.15,-0.9; 3 1.15,0.9; 4 -1.15,0.9

### Placement (x,y rotation side)
C33  36.83,23.37 0 top
C34  37.34,18.03 0 top
C35  48.77,22.86 0 top
C58  39.37,84.33 90 bottom
C59  57.15,18.03 90 bottom
C60  54.1,12.95 90 top
C61  46.48,64.52 90 top
C62  36.32,11.43 0 bottom
FID1  81.53,86.36 0 top
FID2  11.68,81.53 0 top
FID3  62.74,40.64 0 top
FID4  9.91,8.13 0 top
FID5  20.07,80.77 0 bottom
FID6  44.45,2.29 0 bottom
FID7  78.99,71.88 0 bottom
FID8  2.79,52.32 0 bottom
H1  84.44,44.45 270 top
H2  89.52,44.45 270 top
H13  43.43,19.3 0 top
IC11  43.43,24.64 0 top
IC17  46.23,28.45 270 bottom
IC18  41.91,59.44 270 top
IC19  38.1,5.84 180 bottom
JP1  26.67,81.28 0 top
LED11  37.08,25.4 270 top
LED17  78.99,76.2 0 top
MNT1  4.91,85.07 0 top
MNT2  90.63,81.26 0 top
MNT3  4.91,5.05 0 top
MNT4  90.63,7.6 0 top
Q23  49.28,25.91 270 top
Q24  49.28,28.45 270 top
Q35  43.69,45.47 270 bottom
Q36  43.69,48.51 270 bottom
Q39  75.95,17.78 270 bottom
Q40  75.95,20.83 270 bottom
Q41  52.58,9.91 270 bottom
Q42  52.07,6.86 270 bottom
Q43  39.88,64.01 0 top
Q44  43.43,64.01 0 top
Q45  33.27,7.62 270 bottom
Q46  33.27,4.06 270 bottom
R4  27.05,7.11 270 top
R5  30.1,7.11 270 top
R10  80.01,72.14 90 top
R20  45.97,45.47 90 bottom
R21  45.97,48.51 90 bottom
R51  45.47,29.21 0 top
R52  39.62,22.1 90 top
R53  47.5,25.91 90 top
R54  47.24,28.45 90 top
R77  78.23,17.78 90 bottom
R78  78.23,20.83 90 bottom
R79  54.61,9.91 90 bottom
R80  54.1,6.86 90 bottom
R83  39.88,61.47 180 top
R84  43.43,61.47 180 top
R85  35.56,7.62 90 bottom
R86  35.56,4.06 90 bottom
RN11  39.37,28.19 90 top
SJ8  44.96,59.44 90 top
SJ9  36.32,9.91 0 bottom
SW11  49.02,20.32 270 top
SW18  53.85,18.8 90 top
U$33  [OSHW_10X200_NOTEXT]  56.32,3.61 0 top
X1  56.75,42.51 180 bottom
X2  50.96,22.61 270 bottom
X3  75.76,31.04 90 bottom
X4  61.76,6.04 180 bottom
XTL11  37.34,20.57 270 top

### Tracks (layer width: path | path; a pad name or v marks a point on that pad's centre or on a via)
3.3V  (via drill 0.5)
  Top 0.254: C61.1 46.48,62.48 v46.99,61.98 45.97,60.96 45.97,59.18 45.75,58.96 SJ8.1
  Bottom 0.203: IC17.1 IC17.12 46.23,30.73 46.48,30.99 53.59,30.99 54.36,30.23 58.42,30.23 | 43.94,43.94 43.69,44.2 43.69,46.23 | Q36.1 44.08,48.91 43.69,48.51 43.69,46.23 | 43.69,46.23 44.49,46.23 | Q40.1 76.6,21.48 75.95,20.83 75.95,19.05 76.57,18.43 Q39.1
  Bottom 0.254: R80.2 53.93,7.51 Q42.1 52.69,7.51 52.07,8.13 51.05,8.13 49.02,10.16 49.02,11.43 50.04,12.45 51.49,12.45 | Q36.1 45.8,49.16 R21.2 | R20.2 45.8,46.12 Q35.1 44.49,46.23 | R78.2 78.06,21.48 Q40.1 76.38,21.84 69.34,21.84 68.83,22.35 | R77.2 78.06,18.43 Q39.1 | 59.78,8.64 X4.4 | 51.49,12.45 Q41.1 54.44,10.56 R79.2 57.3,13.08 57.78,13.08 | 51.49,12.45 51.56,12.45 | X1.5 54.87,46.22 54.61,46.48 49.02,46.48 46.48,43.94 43.94,43.94 | X2.2 48.94,19.48 48.26,18.8 48.26,12.95 44.7,9.4 38.61,9.4 38.1,9.91 SJ9.1 C62.1
  Bottom 0.305: 57.1,19.48 C59.A
  Bottom 0.406: 73.17,28.45 X3.6 | v46.99,61.98 61.21,47.75 61.21,44.2 57.66,40.64
  Bottom 0.61: X2.2 55.12,19.48 | 55.12,19.48 57.1,19.48 | 73.17,28.45 71.12,28.45 68.83,26.16 68.83,22.35 67.06,20.57 64.01,20.57 62.87,19.43 C59.A 57.15,22.86 58.42,24.13 58.42,30.23 58.42,39.88 57.66,40.64 54.87,43.42 X1.5 | X4.4 59.88,10.98 57.78,13.08 55.12,15.75 55.12,19.48 | X3.6 73.35,28.45 v75.69,28.45
5V  (via drill 0.5)  (3 unrouted)
  Top 0.254: 78.23,76.21 LED17.A | 26.16,6.86 26.39,6.63 R4.2 27.15,6.63 v28.19,5.59 29.05,5.59 R5.2 | 78.51,73.15 LED17.A | 78.23,77.98 78.51,77.7 LED17.A
  Top 0.305: 49.02,20.32 48.77,20.32
  Top 0.406: 48.77,20.32 SW11.2 | 49.21,7.81 49.02,7.62 v49.02,3.81 | 51.05,16.51 50.8,16.76 49.78,16.76 49.02,17.53 49.02,20.32 49.02,21.08 49.21,21.27 SW11.6 50.48,21.27 54.1,24.89 | 51.05,16.51 52.07,15.49 52.07,8.38 51.5,7.81 | SW18.2 54.1,18.8 53.85,18.54 53.85,18.29 53.41,17.85 SW18.6 51.31,16.51 51.05,16.51
  Route2 0.61: v37.85,37.34 35.31,34.8 35.31,10.16 34.54,9.4 v32.77,9.4 | v78.23,55.88 75.69,55.88 74.17,54.36 74.17,46.48 76.45,44.2 76.45,42.42 75.95,41.91 v74.17,41.91 74.17,35.81 73.41,35.05 73.41,23.88 72.64,23.11 70.36,23.11 70.36,13.97 72.64,11.68 72.64,10.16 72.14,9.65 70.87,9.65 v70.36,10.16
  Route15 0.61: v32.77,9.4 38.86,3.3 48.51,3.3 v49.02,3.81 49.53,3.3 60.45,3.3 66.8,9.65 69.85,9.65 v70.36,10.16 | 77.22,71.37 80.77,67.82 80.77,62.48 78.23,59.94 v78.23,55.88
  Bottom 0.61: X3.1 73.26,41 v74.17,41.91 | X1.6 53.62,37.62 52.83,36.83 50.8,36.83 50.29,36.32 46.99,36.32 46.48,36.83 38.35,36.83 v37.85,37.34
+3V3_AS
  Bottom 0.61: 85.6,5.33 86.36,6.1 86.36,10.41 85.71,11.06 H1.52
+5V_AS
  Bottom 0.61: 78.49,5.33 78.99,5.84 78.99,9.91 79.76,10.67 81.9,12.7 H1.51
+5V_SRC  (via drill 0.5)
  Top 0.61: v73.66,8.13 v73.66,9.14
  Route15 0.61: JP1.3 29.46,84.07 21.34,84.07 19.3,86.11 15.24,86.11 6.86,77.72 6.86,66.8 2.54,62.48 2.54,20.57 3.81,19.3 3.81,13.46 9.65,7.62 9.65,3.3 11.68,1.27 60.2,1.27 67.06,8.13 v73.66,8.13
  Bottom 0.61: v73.66,9.14 v73.66,8.13
+5V_SYS
  Bottom 0.61: H2.25 H2.26 92.2,44.31 92.2,14.73 91.44,13.97 81.03,13.97 76.96,9.91
BOTTOM_SCL
  Bottom 0.254: Q42.2 53.93,6.21 R80.1 54.13,6.35 54.13,3.78 55.88,2.03 61.72,2.03 63.75,4.06 63.75,8.42 X4.1
BOTTOM_SDA
  Bottom 0.254: Q41.2 54.44,9.26 | 54.44,9.26 R79.1 | X4.2 62.38,3.46 61.59,2.67 61.47,2.54 56.13,2.54 55.37,3.3 55.37,8.64 54.75,9.26 54.44,9.26
D28_N11_PWR  (via drill 0.5)
  Top 0.254: SW11.4 50.04,19.19 v50.04,18.03
  Route2 0.254: v50.04,18.03 49.02,19.05 49.02,27.43
GEIGER_SCL
  Bottom 0.254: Q36.2 45.8,47.86 R21.1 | X1.1 59.94,45.08 59.94,48.01 58.93,49.02 55.88,49.02 54.36,47.5 46.48,47.5 45.95,48.03 R21.1 | 46,48.01 R21.1
GEIGER_SDA
  Bottom 0.254: Q35.2 45.8,44.82 R20.1 46.51,44.99 48.51,46.99 54.61,46.99 56.13,48.51 57.66,48.51 58.67,47.5 58.67,45.05 X1.2
GND  (via drill 0.5)  (1 unrouted)
  Top 0.203: IC18.2 41.15,59.44 | IC18.2 41.66,59.44 41.91,59.18 41.91,58.93 | 41.91,58.93 42.3,58.93 IC18.4 | 41.91,58.93 41.91,58.17 | IC18.2 40.39,59.44
  Top 0.254: v42.67,23.88 v42.67,25.4 42.41,25.39 IC11.3 40.4,25.39 40.13,25.65 40.13,26.91 RN11.1 | IC11.5 42.67,24.39 v42.67,23.88 | IC11.21 44.7,24.89 v44.2,23.88 | v44.2,25.4 v44.2,23.88 | v42.67,23.88 v44.2,23.88 | IC11.TGND v42.67,23.88
  Bottom 0.203: IC17.6 46.23,26.67 | IC19.2 38.1,7.37
  Bottom 0.254: X1.3 57.37,46.51 v56.64,47.24
  other vias: 3.81,78.74 2.54,78.74 75.44,26.92 55.88,13.21 2.54,77.47 2.54,76.2 2.54,74.93 3.81,77.47 3.81,76.2 28.45,88.9 23.37,88.9 27.18,88.9 25.91,88.9 24.64,88.9 30.99,88.9 29.72,88.9 22.1,88.9 20.83,88.9 32.26,88.9 37.34,88.9 36.07,88.9 34.8,88.9 33.53,88.9 19.56,88.9 1.27,11.43 1.27,10.16 1.27,13.97 1.27,12.7 1.27,15.24 1.27,16.51 1.27,17.78 1.27,19.05 1.27,8.89 1.27,66.04 1.27,67.31 1.27,68.58 1.27,69.85 1.27,71.12 1.27,72.39 1.27,73.66 1.27,74.93 1.27,76.2 1.27,77.47 1.27,78.74 76.2,34.29 65.79,1.02 67.06,1.02 63.75,1.02 62.48,1.02
  pour Bottom (isolate 0.203): 0,86.3 arc-90 3,89.3 9,89.3 11.2,90.3 79.56,90.3 86.64,85.6 92.45,85.6 arc-90 95.45,82.6 95.45,76.74 93.55,72.91 93.55,16.05 95.45,12.31 95.45,5.08 arc-90 92.45,2.3 75.83,2.3 71.54,0 10.16,0 7.81,1 3,1 arc-90 0,4
  pour Top (isolate 0.203): 0,86.3 arc-90 3,89.3 9,89.3 11.2,90.3 79.56,90.3 86.64,85.6 92.45,85.6 arc-90 95.45,82.6 95.45,76.74 93.55,72.91 93.55,16.05 95.45,12.31 95.45,5.08 arc-90 92.45,2.3 75.83,2.3 71.54,0 10.16,0 7.81,1 3,1 arc-90 0,4
  pour Route15 (isolate 0.203): 0,86.3 arc-90 3,89.3 9,89.3 11.2,90.3 79.56,90.3 86.64,85.6 92.45,85.6 arc-90 95.45,82.6 95.45,76.74 93.55,72.91 93.55,16.05 95.45,12.31 95.45,5.08 arc-90 92.45,2.3 75.83,2.3 71.54,0 10.16,0 7.81,1 3,1 arc-90 0,4
  pour Route2 (isolate 0.203): 0,86.3 arc-90 3,89.3 9,89.3 11.2,90.3 79.56,90.3 86.64,85.6 92.45,85.6 arc-90 95.45,82.6 95.45,76.74 93.55,72.91 93.55,16.05 95.45,12.31 95.45,5.08 arc-90 92.45,2.3 75.83,2.3 71.54,0 10.16,0 7.81,1 3,1 arc-90 0,4
GPS_5V  (via drill 0.5)
  Top 0.305: 53.85,14.61 C60.A
  Top 0.406: 53.85,14.61 v53.85,16 55.05,17.2 SW18.1
  Bottom 0.305: X2.1 53.85,17.84
  Bottom 0.406: 53.85,17.84 v53.85,16
N11_5V  (via drill 0.5)
  Top 0.203: 48.77,24.13 49.28,24.64 49.28,26.67 | 48.63,29.1 49.28,28.45 49.28,26.67 | 48.59,26.67 49.28,26.67 | R51.2 45.95,30 v45.21,30.73
  Top 0.254: IC11.18 46.5,23.39 | IC11.4 40.38,24.89 40.26,24.77 | 48.37,29.1 Q24.1 | 48.37,26.56 Q23.1 | H13.2 46.74,19.61 46.74,20.83 47.18,21.27 SW11.1 47.75,21.34 | IC11.6 40.37,23.89 40.13,24.13 40.13,24.64 40.26,24.77 | 40.26,24.77 39.62,25.4 37.34,25.4 37.08,25.15 LED11.5 LED11.6 35.56,25.47 35.56,27.69 38.1,30.23 44.7,30.23 v45.21,30.73 | Q24.1 48.31,28.93 R54.2 46.96,29.21 R51.2 | R53.2 48.31,26.39 Q23.1 | IC11.20 46.48,24.39 | Q24.1 48.63,29.1 | Q23.1 48.59,26.67 | 47.78,23.09 47.75,23.11
  Top 0.305: 46.5,23.39 46.74,23.62 46.74,24.13 | 46.48,24.39 46.74,24.13 | 48.77,24.13 47.75,24.13 | 47.75,24.13 46.74,24.13 | 47.75,21.34 47.75,23.11 47.75,24.13 | C35.1 47.78,23.09
  Route2 0.254: H13.2 45.48,18.3
  Bottom 0.203: v45.21,30.73 45.58,30.37 IC17.11
N11_A4_SDA
  Top 0.254: IC11.27 44.18,27.67 44.45,27.94 45.47,27.94 46.74,26.67 46.74,25.65 46.96,25.43 R53.1 48.31,25.43 Q23.2
N11_A5_SCL
  Top 0.254: IC11.28 43.68,27.94 44.2,28.45 45.97,28.45 46.48,27.94 47.22,27.94 R54.1 48.31,27.97 Q24.2
N11_D0_RX  (via drill 0.5)
  Top 0.254: IC11.30 42.68,28.69 v42.16,29.21 41.4,29.21 41.22,29.39 RN11.4
N11_D1_TX  (via drill 0.5)
  Top 0.254: IC11.31 42.18,27.67 41.66,28.19 v41.15,28.19 40.75,27.79 RN11.2
N11_D6  (via drill 0.5)
  Top 0.203: IC11.10 42.18,21.61 41.91,21.34 40.89,21.34 39.37,19.81 39.37,17.78 v38.86,17.27
  Bottom 0.203: v38.86,17.27 38.86,21.84 40.13,23.11 40.13,26.42 40.89,27.18 41.91,27.18 42.93,28.19 44.2,28.19 44.45,28.45 IC17.9
N11_D7  (via drill 0.5)
  Top 0.203: IC11.11 42.68,21.35 42.42,21.08 42.42,17.78 41.66,17.02 v40.39,17.02
  Bottom 0.203: v40.39,17.02 39.62,17.78 39.62,21.84 40.64,22.86 40.64,26.16 41.15,26.67 42.16,26.67 43.18,27.69 44.45,27.69 44.81,28.05 IC17.8
N11_D11_MOSI
  Top 0.203: 44.45,21.08 44.45,19.32
  Top 0.254: IC11.15 44.68,21.32 44.45,21.08 | 44.45,19.32 H13.4
N11_D12_MISO
  Top 0.254: IC11.16 45.18,20.55 H13.1
N11_D13_SCK  (via drill 0.5)
  Top 0.254: v46.23,21.84 45.78,22.29 IC11.17 | v39.12,24.38 38.26,24.38 LED11.4
  Route15 0.254: v39.12,24.38 41.66,21.84 43.43,21.84 | 43.43,21.84 v46.23,21.84 | H13.3 43.43,21.84
N11_RESET  (via drill 0.5)
  Top 0.254: R51.1 43.95,29.21 v43.69,29.21 43.18,28.71 IC11.29
  Route2 0.254: v43.69,29.21 41.43,26.96 H13.5
N$14
  Top 0.254: LED17.C 80.01,75.93 R10.2
N$6470
  Top 0.254: IC11.8 41.08,22.54 40.16,21.62 R52.1 39.62,20.81 XTL11.3 38.24,18.45 C34.2
N$6471
  Top 0.254: IC11.7 39.62,23.39 | R52.2 39.62,23.39 | XTL11.1 37.08,22.37 37.08,22.89 C33.2 37.33,23.39 39.62,23.39
N$6472
  Top 0.254: RN11.7 37.95,27.79 37.08,26.92 LED11.2
N$6473
  Top 0.254: RN11.8 38.7,26.96 LED11.1
N$6474
  Top 0.254: RN11.5 38.03,29.39 36.33,27.7 LED11.3
N$9999
  Top 0.203: IC18.1 40.36,60.84 R83.1
  Top 0.254: R83.1 40.53,61.64 Q43.2
N$10001
  Top 0.203: IC18.6 43.43,59.94 43.94,60.45 43.94,61.44 R84.1
  Top 0.254: R84.1 44.08,61.64 Q44.2
N$10002
  Bottom 0.203: IC19.6 37.6,4.07 37.08,3.56 35.59,3.56 R86.1
  Bottom 0.254: R86.1 35.39,3.41 Q46.2
N$10003
  Bottom 0.203: IC19.1 37.6,6.85 37.34,7.11 35.59,7.11 R85.1
  Bottom 0.254: R85.1 35.39,6.97 Q45.2
N$10008
  Bottom 0.61: 75.44,5.33 76.45,5.33
N$10009
  Bottom 0.61: 82.55,5.33 83.57,5.33
N$10010
  Top 0.203: SJ8.2 44.96,63.75 44.7,64.01 43.58,64.01 Q44.1 41.98,64.01 39.88,64.01 39.23,63.36 | 43.43,59.44 IC18.5
  Top 0.254: R83.2 39.23,61.64 Q43.1 39.23,63.36 | R84.2 42.78,61.64 Q44.1 | 43.43,59.44 43.69,59.44 44.2,59.94 44.93,59.94 SJ8.2
N$10011
  Bottom 0.203: IC19.4 IC19.5 38.1,5.59 37.85,5.84 36.86,5.84 R86.2 | Q45.1 33.92,8.27 33.27,7.62 33.27,5.51 Q46.1
  Bottom 0.254: Q45.1 35.39,8.27 R85.2 35.56,9.4 35.84,9.68 SJ9.2 | R86.2 35.39,4.71 Q46.1
PWR_GEIGER  (via drill 0.5)
  Bottom 0.254: X1.4 56.12,43.7 57.4,42.42 v57.66,42.42
PWR_SPEC
  Bottom 0.254: X3.2 74.68,33.53 74.93,33.78 74.93,35.31 74.17,36.07
RST_GPS  (via drill 0.5)
  Bottom 0.254: X2.3 54.77,20.73 v55.63,21.59
RST_SPEC
  Bottom 0.254: X3.3 68.55,32.28
RTS
  Bottom 0.254: C58.1 JP1.6
RX_GPS
  Bottom 0.203: IC17.4 47.39,28.05 47.75,27.69 47.75,26.16 48.26,25.65 50.8,25.65 51.97,24.48 X2.6
RXD1  (1 unrouted)
  Route2 0.254: H1.36 87,34.3 87,78.11
SCL  (via drill 0.5)  (6 unrouted)
  Top 0.254: v50.29,27.18 50.29,28.23 Q24.3 | v31.24,7.11 30.76,7.59 R5.1 | Q43.3 39.84,64.77 39.59,65.02 v38.1,65.02
  Route15 0.254: v50.29,13.72 56.64,20.07 v71.63,20.07 74.42,22.86 H1.43
  Bottom 0.203: 33.02,3.05 33.27,3.3 33.27,4.57 32.51,5.33
  Bottom 0.254: Q36.3 40.39,48.51 | Q40.3 74.93,20.83 73.91,19.81 73.91,16.26 74.68,15.49 79.25,15.49 81.03,17.27 81.03,22.35 81.53,22.86 H1.43 | Q42.3 51.05,6.86 48.26,9.65 48.26,11.68 v50.29,13.72 | 30.23,4.06 31.24,3.05 33.02,3.05 | 32.51,5.33 32.51,7.58 Q45.3 31.75,7.62 v31.24,7.11
SDA  (via drill 0.5)  (6 unrouted)
  Top 0.254: v50.29,24.64 50.29,25.69 Q23.3 | v28.7,7.37 28.48,7.59 R4.1 | Q44.3 42.2,66.04 37.59,66.04 37.08,65.53 37.08,64.77 38.1,63.75 v38.1,62.23
  Route15 0.254: v50.29,11.18 58.67,19.56 69.6,19.56 v71.63,17.53 72.64,18.54 72.64,20.32 74.68,22.35 81.28,22.35 82.04,21.59 83.69,21.59 84.45,22.35 84.45,24.11 H1.41 | v50.29,24.64 51.05,24.64
  Bottom 0.254: Q35.3 39.88,45.47 | 74.93,17.78 Q39.3 75.15,16.55 75.69,16 78.99,16 80.52,17.53 80.52,24.89 81.03,25.4 H1.41 | Q41.3 51.56,9.91 v50.29,11.18 | v28.7,7.37 32,4.06 Q46.3
SPEC_SCL
  Bottom 0.254: Q40.2 78.06,20.18 R78.1 78.26,20.32 78.99,20.32 79.5,20.83 79.5,28.45 78.17,29.79 X3.5
SPEC_SDA
  Bottom 0.254: Q39.2 78.06,17.13 R77.1 78.26,17.27 79.5,17.27 80.01,17.78 80.01,28.7 77.68,31.04 X3.4
TX_GPS
  Bottom 0.203: IC17.3 48.01,28.45 48.26,28.19 48.26,26.67 48.77,26.16 51.05,26.16 51.56,26.67 51.56,27.43 52.07,27.94 54.61,27.94 55.12,27.43 55.12,23.62 54.73,23.23 X2.5
TXD1  (1 unrouted)
  Route2 0.254: H1.34 84.45,36.81 84.45,78.11
VCC_SYS  (via drill 0.5)
  Route2 0.61: H2.27 H2.28 92.2,41.77 92.2,11.94 91.19,10.92 86.87,10.92 v85.09,9.14 v85.09,8.13
  Bottom 0.61: v85.09,9.14 85.09,8.64 v85.09,8.13

### Text on the board
tPlace: RESET | BLACK | GREEN | H1 | H2 | CTS | 5V | RX | TX | RTS | CONSOLE | PWR | v1.0 | TEMP | 0x48 | by Jon Oxer | 1 | 1 | LibreSat Sensor Module | I2C bus | www.ardusat.org | pullups | (optional) | /Users/jon/Dropbox/Freetronics/ConsultingProjects/ArduSat/nanosatisfi 2-2 BW.bmp | freetronics | www.freetronics.com/lssm
bPlace: freetronics | Copyright 2013 Freetronics Pty Ltd / www.freetronics.com/asppm / / Released under the TAPR / Open Hardware Licence / www.tapr.org/OHL / / SKU: ASPPM | Geiger | Spectruino | GPS | BUS POWER | NODE | H2:25/26 | H2:27/28 | RESET | LATCH | 0x49 | H1:51 | H1:52 | ADDR | A0 | TEMP | A1 | 5V | 3V3 | DEFAULT | Bottom Plate | 0x24 | A2
tNames: LED9 | LED15 | LED11 | LED16 | LED12
bNames: IC17 | IC25